# Altium schematic sheet Digital_Signals.SchDoc
size A4; CompanyName: Technische Hochschule Nürnberg Georg Simon Ohm; Organization: UltraZohm; Address1: Kesslerplatz 12; Address2: 90489 Nürnberg; Address3: GERMANY; DocumentNumber: 3; SheetNumber: 4; SheetTotal: 6; Website: www.ultrazohm.com
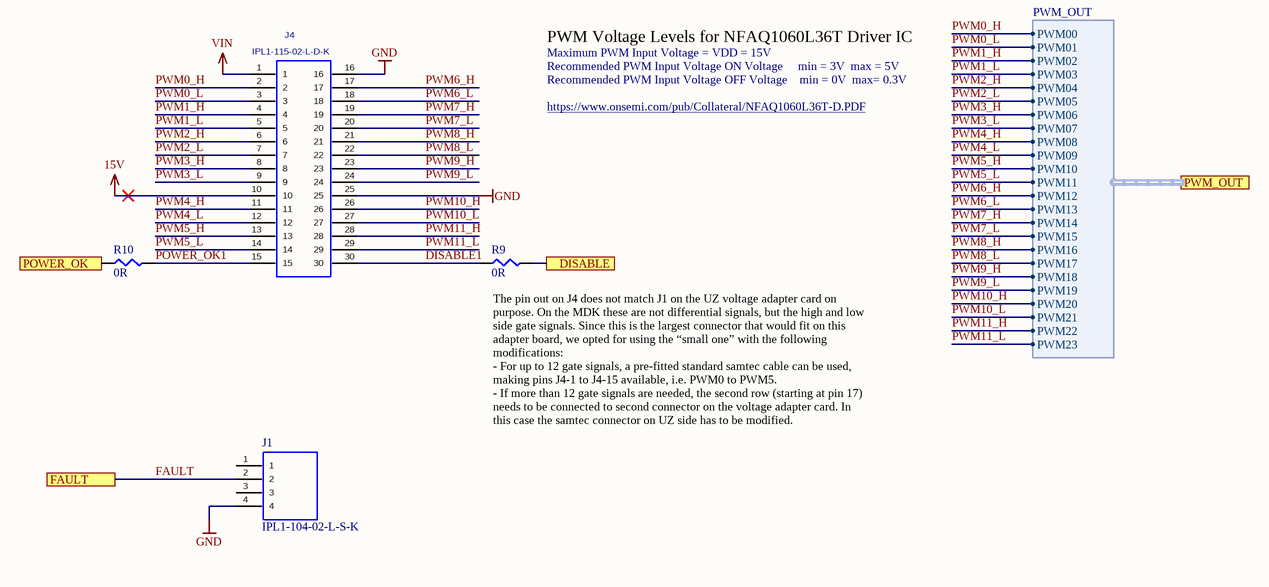
[diagram p0: Digital_Signals.SchDoc]

## Parts
J1  IPL1-104-02-L-S-K  [IPL1-104-02-L-S-K]
J4  IPL1-115-02-L-D-K  [IPL1-115-02-L-D-K]
R9  0R  [RESC0603]
R10  0R  [RESC0603]

## Ports
DISABLE, FAULT, POWER_OK, PWM_OUT (harness PWM_OUT)

## Harnesses
PWM_OUT: PWM00, PWM01, PWM02, PWM03, PWM04, PWM05, PWM06, PWM07, PWM08, PWM09, PWM10, PWM11, PWM12, PWM13, PWM14, PWM15, PWM16, PWM17, PWM18, PWM19, PWM20, PWM21, PWM22, PWM23

## Nets
15V: J4.10
GND: J1.4 J4.16 J4.25
VIN: J4.1
DISABLE: R9.2 ; port DISABLE
DISABLE1: J4.30 R9.1
FAULT: J1.2 ; port FAULT
POWER_OK: R10.1 ; port POWER_OK
POWER_OK1: J4.15 R10.2
PWM0_H: J4.2 ; port PWM_OUT.PWM00
PWM0_L: J4.3 ; port PWM_OUT.PWM01
PWM1_H: J4.4 ; port PWM_OUT.PWM02
PWM1_L: J4.5 ; port PWM_OUT.PWM03
PWM2_H: J4.6 ; port PWM_OUT.PWM04
PWM2_L: J4.7 ; port PWM_OUT.PWM05
PWM3_H: J4.8 ; port PWM_OUT.PWM06
PWM3_L: J4.9 ; port PWM_OUT.PWM07
PWM4_H: J4.11 ; port PWM_OUT.PWM08
PWM4_L: J4.12 ; port PWM_OUT.PWM09
PWM5_H: J4.13 ; port PWM_OUT.PWM10
PWM5_L: J4.14 ; port PWM_OUT.PWM11
PWM6_H: J4.17 ; port PWM_OUT.PWM12
PWM6_L: J4.18 ; port PWM_OUT.PWM13
PWM7_H: J4.19 ; port PWM_OUT.PWM14
PWM7_L: J4.20 ; port PWM_OUT.PWM15
PWM8_H: J4.21 ; port PWM_OUT.PWM16
PWM8_L: J4.22 ; port PWM_OUT.PWM17
PWM9_H: J4.23 ; port PWM_OUT.PWM18
PWM9_L: J4.24 ; port PWM_OUT.PWM19
PWM10_H: J4.26 ; port PWM_OUT.PWM20
PWM10_L: J4.27 ; port PWM_OUT.PWM21
PWM11_H: J4.28 ; port PWM_OUT.PWM22
PWM11_L: J4.29 ; port PWM_OUT.PWM23

Not connected (* = marked no-connect by the designer): J1 1 3

## Notes on the sheet
- PWM Voltage Levels for NFAQ1060L36T Driver IC
- Maximum PWM Input Voltage = VDD = 15V
- Recommended PWM Input Voltage OFF Voltage    min = 0V  max= 0.3V
- Recommended PWM Input Voltage ON Voltage     min = 3V  max = 5V
- https://www.onsemi.com/pub/Collateral/NFAQ1060L36T-D.PDF
- (near R9) The pin out on J4 does not match J1 on the UZ voltage adapter card on purpose. On the MDK these are not differential signals, but the high and low side gate signals. Since this is the largest connector that would fit on this adapter board, we opted for using the “small one” with the following modifications:
  - For up to 12 gate signals, a pre-fitted standard samtec cable can be used, making pins J4-1 to J4-15 available, i.e. PWM0 to PWM5.
  - If more than 12 gate signals are needed, the second row (starting at pin 17) needs to be connected to second connector on the voltage adapter card. In this case the samtec connector on UZ side has to be modified.
- Title
- Revision:
- Design Engineer:
- Date:
- Project:
- Sheet
- of

## Library data of the parts
J4 = IPL1-115-01-XX-D-RA: Terminal Assembly, Double Row, Right Angle, Thru-Hole, 0.100" x 0.100" Pitch, 30 Pins.; MPN: IPL1-115-01-L-D-RA-K; MF: SAMTEC; Created: 2019-12-17_Wendy_Xin; HelpURL: https://www.samtec.com/products/ipl1; ComponentLink1Description: Datasheet; ComponentLink1URL: http://suddendocs.samtec.com/catalog_english/ipl1.pdf; Package: IPL1-115-02-L-D-K; Supplier 2: Farnell; Supplier Part Number 2: 2018467; Supplier 1: Digi-Key; Supplier Part Number 1: SAM9611-ND; Supplier 3: Mouser; Supplier Part Number 3: 200-IPL111501LDRAK
R9 R10 = RES_SMD: RES SMD; Part Number: Generic 1% tol.; VALUE: 0R; Publisher: Generic
J1 = IPL1-104-02-L-S-K: URL: https://www.samtec.com/products/ipl1-104-02-l-s-k#models